# Altium schematic sheet Interface.SchDoc: Interface
size A3; PageSetup: Record=PageOptions|CenterHorizontal=True|CenterVertical=True|PrintScale=1.00|XCorrection=1.00|YCorrection=1.00|PrintKind=1|BorderSize=5000000|LeftOffset=0|BottomOffset=0|Orientation=2|PaperLength=1000|PaperWidth=1000|Scale=100|PaperSource=15|PrintQuality=1200|MediaType=1|DitherType=10|PrintScaleMode=1|PaperKind=A4|PaperIndex=9; Organization: Altium Limited; Address1: L3, 12a Rodborough Rd; Address2: Frenchs Forest; Address3: NSW; Address4: Australia 2086; DocumentNumber: 1; Revision: 1.0; SheetNumber: 3; SheetTotal: 4
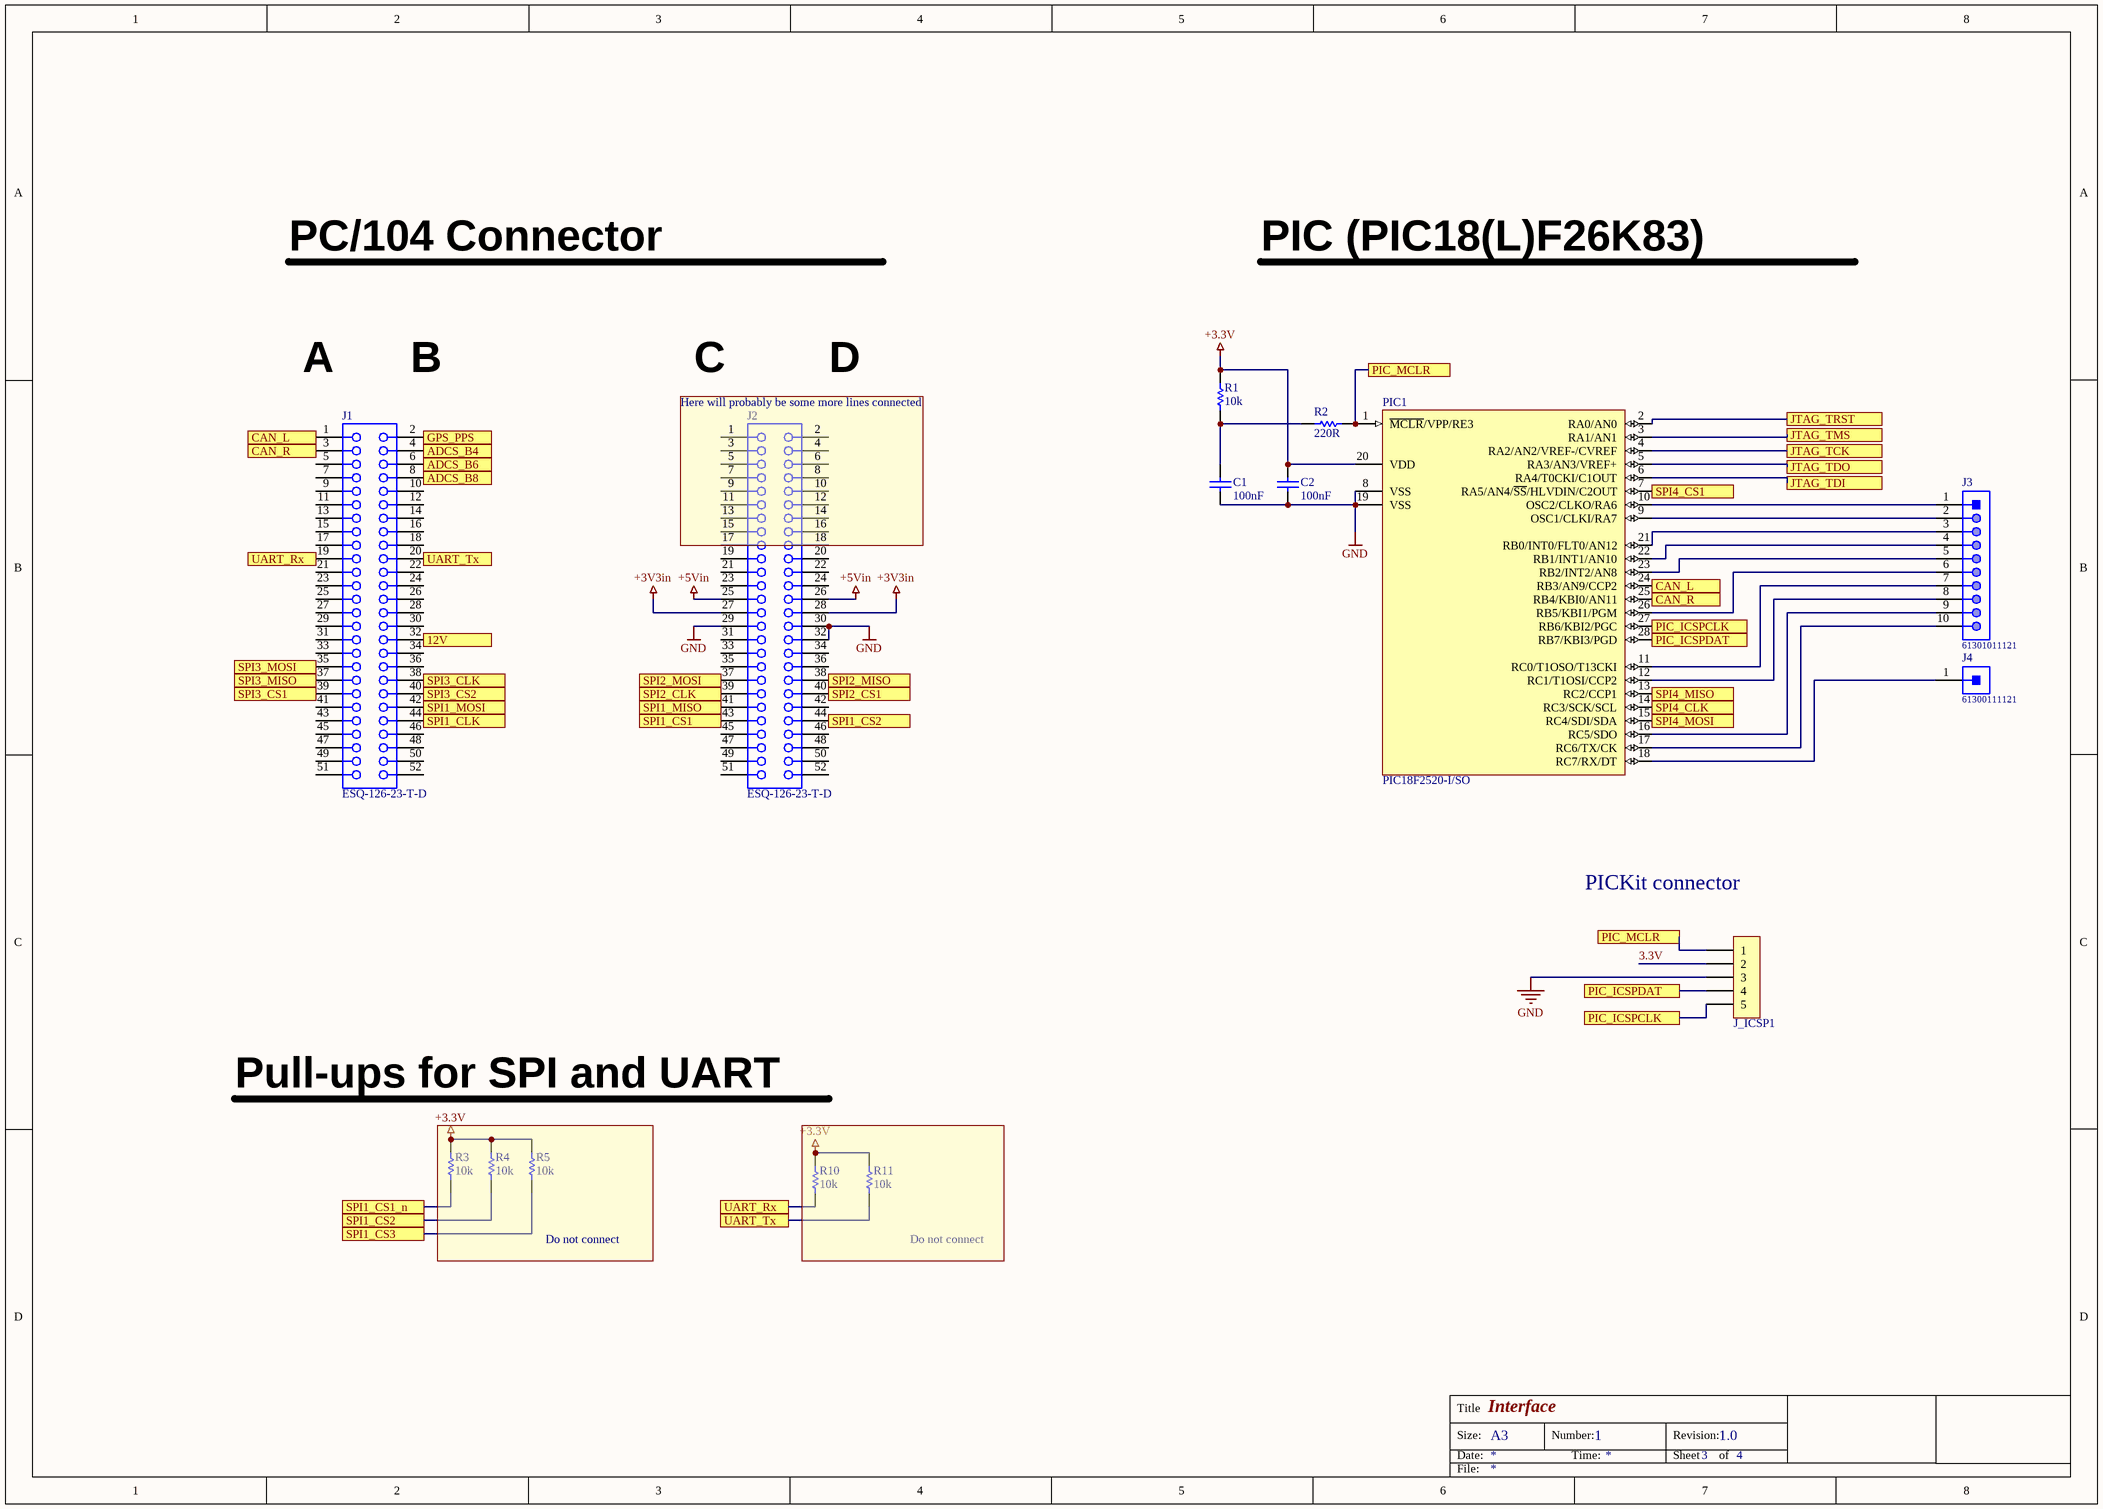
[diagram p0: Interface.SchDoc]

## Parts
C1  100nF  [CAPC1005X60X30ML05T10]
C2  100nF  [CAPC1005X60X30ML05T10]
J1  ESQ-126-23-T-D  [SMTC-ESQ-126-23-X-D]
J2  ESQ-126-23-T-D  [SMTC-ESQ-126-23-X-D]
J3  61301011121  [61301011121]
J4  61300111121  [61300111121]
J_ICSP1  *  [HDR1X5]  (value not drawn)
PIC1  PIC18F2520-I/SO  [SOIC-SO28_L]
R1  10k  [RESC1005X40X25LL05T10]
R2  220R  [RESC1005X40X25ML05T10]
R3  10k  [RESC1005X40X25LL05T10]
R4  10k  [RESC1005X40X25LL05T10]
R5  10k  [RESC1005X40X25LL05T10]
R10  10k  [RESC1005X40X25LL05T10]
R11  10k  [RESC1005X40X25LL05T10]

## Blocks framed on the sheet
Do not connect: R3-R5
Do not connect: R10 R11

## Ports
12V, ADCS_B4, ADCS_B6, ADCS_B8, CAN_L, CAN_R, GPS_PPS, JTAG_TCK, JTAG_TDI, JTAG_TDO, JTAG_TMS, JTAG_TRST, PIC_ICSPCLK, PIC_ICSPDAT, PIC_MCLR, SPI1_CLK, SPI1_CS1, SPI1_CS1_n, SPI1_CS2, SPI1_CS3, SPI1_MISO, SPI1_MOSI, SPI2_CLK, SPI2_CS1, SPI2_MISO, SPI2_MOSI, SPI3_CLK, SPI3_CS1, SPI3_CS2, SPI3_MISO, SPI3_MOSI, SPI4_CLK, SPI4_CS1, SPI4_MISO, SPI4_MOSI, UART_Rx, UART_Tx

## Nets
+3.3V: C2.2 PIC1.20(VDD) R1.2 R3.2 R4.2 R5.2 R10.2 R11.2
+3V3in: J2.27 J2.28
+5Vin: J2.25 J2.26
GND: C1.1 C2.1 J2.29 J2.30 J2.32 J_ICSP1.3 PIC1.8(VSS) PIC1.19(VSS)
3.3V: J_ICSP1.2
12V: J1.32 ; port 12V
ADCS_B4: J1.4 ; port ADCS_B4
ADCS_B6: J1.6 ; port ADCS_B6
ADCS_B8: J1.8 ; port ADCS_B8
CAN_L: J1.1 PIC1.24(RB3/AN9/CCP2) ; port CAN_L
CAN_R: J1.3 PIC1.25(RB4/KBI0/AN11) ; port CAN_R
GPS_PPS: J1.2 ; port GPS_PPS
JTAG_TCK: PIC1.4(RA2/AN2/VREF-/CVREF) ; port JTAG_TCK
JTAG_TDI: PIC1.6(RA4/T0CKI/C1OUT) ; port JTAG_TDI
JTAG_TDO: PIC1.5(RA3/AN3/VREF+) ; port JTAG_TDO
JTAG_TMS: PIC1.3(RA1/AN1) ; port JTAG_TMS
JTAG_TRST: PIC1.2(RA0/AN0) ; port JTAG_TRST
PIC_ICSPCLK: J_ICSP1.5 PIC1.27(RB6/KBI2/PGC) ; port PIC_ICSPCLK
PIC_ICSPDAT: J_ICSP1.4 PIC1.28(RB7/KBI3/PGD) ; port PIC_ICSPDAT
PIC_MCLR: J_ICSP1.1 PIC1.1(~{MCLR}/VPP/RE3) R2.2 ; port PIC_MCLR
SPI1_CLK: J1.44 ; port SPI1_CLK
SPI1_CS1: J2.43 ; port SPI1_CS1
SPI1_CS1_n: R3.1 ; port SPI1_CS1_n
SPI1_CS2: J2.44 R4.1 ; port SPI1_CS2
SPI1_CS3: R5.1 ; port SPI1_CS3
SPI1_MISO: J2.41 ; port SPI1_MISO
SPI1_MOSI: J1.42 ; port SPI1_MOSI
SPI2_CLK: J2.39 ; port SPI2_CLK
SPI2_CS1: J2.40 ; port SPI2_CS1
SPI2_MISO: J2.38 ; port SPI2_MISO
SPI2_MOSI: J2.37 ; port SPI2_MOSI
SPI3_CLK: J1.38 ; port SPI3_CLK
SPI3_CS1: J1.39 ; port SPI3_CS1
SPI3_CS2: J1.40 ; port SPI3_CS2
SPI3_MISO: J1.37 ; port SPI3_MISO
SPI3_MOSI: J1.35 ; port SPI3_MOSI
SPI4_CLK: PIC1.14(RC3/SCK/SCL) ; port SPI4_CLK
SPI4_CS1: PIC1.7(RA5/AN4/~{SS}/HLVDIN/C2OUT) ; port SPI4_CS1
SPI4_MISO: PIC1.13(RC2/CCP1) ; port SPI4_MISO
SPI4_MOSI: PIC1.15(RC4/SDI/SDA) ; port SPI4_MOSI
UART_Rx: J1.19 R10.1 ; port UART_Rx
UART_Tx: J1.20 R11.1 ; port UART_Tx
NetC1_2: C1.2 R1.1 R2.1
NetJ3_1: J3.1 PIC1.10(OSC2/CLKO/RA6)
NetJ3_2: J3.2 PIC1.9(OSC1/CLKI/RA7)
NetJ3_3: J3.3 PIC1.21(RB0/INT0/FLT0/AN12)
NetJ3_4: J3.4 PIC1.22(RB1/INT1/AN10)
NetJ3_5: J3.5 PIC1.23(RB2/INT2/AN8)
NetJ3_6: J3.6 PIC1.26(RB5/KBI1/PGM)
NetJ3_7: J3.7 PIC1.11(RC0/T1OSO/T13CKI)
NetJ3_8: J3.8 PIC1.12(RC1/T1OSI/CCP2)
NetJ3_9: J3.9 PIC1.16(RC5/SDO)
NetJ3_10: J3.10 PIC1.17(RC6/TX/CK)
NetJ4_1: J4.1 PIC1.18(RC7/RX/DT)

Not connected (* = marked no-connect by the designer): J1 5 7 9 10 11 12 13 14 15 16 17 18 21 22 23 24 25 26 27 28 29 30 31 33 34 36 41 43 45 46 47 48 49 50 51 52; J2 1 2 3 4 5 6 7 8 9 10 11 12 13 14 15 16 17 18 19 20 21 22 23 24 31 33 34 35 36 42 45 46 47 48 49 50 51 52

## Notes on the sheet
- PC/104 Connector
- PIC (PIC18(L)F26K83)
- A
- B
- C
- D
- (near J2) Here will probably be some more lines connected
- PICKit connector
- Pull-ups for SPI and UART
- Title
- Size:
- Date:
- A3
- Number:
- Time:
- Revision:
- Sheet
- of
- File:

## Library data of the parts
C1 C2 = CMP-2008-02046-1: Manufacturer: Kemet; Part Number: C0402C104K8PACTU
J1 J2 = CMP-1026-00047-1: PC/104(TM) Elevated Socket Strip, Through-hole, Vertical, -55 to 105 degC, 2.54 mm Pitch, 52-Pin, Female, RoHS; Manufacturer: Samtec; Pitch: 2.54 mm; ComponentLink1Description: Manufacturer URL; RoHS: True; PartNumber: ESQ-126-23-T-D; DatasheetVersion: F-214; ComponentLink3Description: Package Specification; Orientation: Vertical; Temperature Range: -55 to 105 degC; ComponentLink1URL: http://www.samtec.com; ComponentLink3URL: http://www.samtec.com/documents/webfiles/cpdf/ESQ-1XX-XX-X-X-XXX-XX-X-XX-MKT.pdf; PackageReference: ESQ-126-23-X-D; Mounting Technology: Through-hole; PackageDescription: ESQ Strip ASM; ComponentLink2Description: Datasheet; PackageVersion: BZ, 9/1998; ComponentLink2URL: http://www.samtec.com/documents/webfiles/pdf/ESQ_TH.PDF
J3 = CMP-1502-01082-1: THT Vertical Pin Header WR-PHD, Pitch 2.54 mm, Single Row, 10 pins; Manufacturer: Wurth Elektronik; Contact Resistance: 20mOhm; Rated Current: 3A; Pitch: 2.54mm; Gender: Male; Pin Number: 10; Working Voltage: 250VAC; Withstanding Voltage: 500VAC; Manufacturer URL: http://www.we-online.de; Operating Temperature: -40to105degC; Datasheet URL: https://katalog.we-online.de/em/datasheet/6130xx11121.pdf; Row Number: Single; Orientation: Vertical; Part Number: 61301011121; Packaging: Bag; Package Reference: 61301011121; Mounting Technology: THT; Publisher: WurthElektronik
J4 = CMP-1502-01058-1: THT Vertical Pin Header WR-PHD, Pitch 2.54 mm, Single Row, 1 pins; Manufacturer: Wurth Elektronik; Gender: Male; Working Voltage: 250VAC; Withstanding Voltage: 500VAC; Pin Number: 1; Contact Resistance: 20mOhm; Rated Current: 3A; Pitch: 2.54mm; Mounting Technology: THT; Datasheet URL: https://katalog.we-online.de/em/datasheet/6130xx11121.pdf; Manufacturer URL: http://www.we-online.de; Operating Temperature: -40to105degC; Publisher: WurthElektronik; Part Number: 61300111121; Row Number: Single; Package Reference: 61300111121; Orientation: Vertical; Packaging: Bag
J_ICSP1 = PinHeader1x5: Plug connector; Value: *
PIC1 = CMP-0116-01078-1: Enhanced Flash Microcontroller with 10-Bit A/D and nanoWatt Technology, 32K Flash, 28-Pin SOIC, Industrial Temperature Range; Code_JEDEC: MS-013; PackageReference: SOIC-SO28; PackageVersion: revBB, Aug-2009; DatasheetVersion: revE, Oct-2008; PackageDescription: 28-Lead Plastic Small Outline (SO) - Wide 7.50mm Body [SOIC]
R1 R3-R5 R10 R11 = CMP-2002-07353-1: Part Number: RC0402FR-0710KL; Manufacturer: Yageo / Phycomp
R2 = CMP-2002-07511-1: Part Number: RC0402FR-07220RL; Manufacturer: Yageo / Phycomp